# EAGLE schematic Colour Sensor (EAGLE 6.5.0)
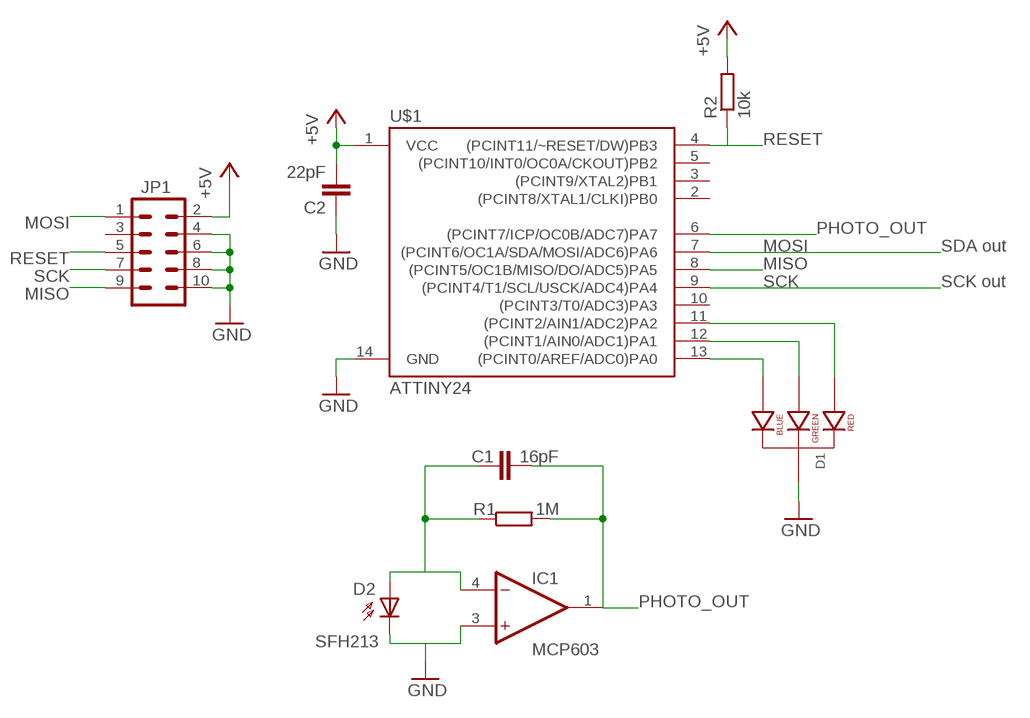
[diagram p0: schematic, sheet 1]

## Parts
C1  16pF  C-EU025-024X044  [C025-024X044]
C2  22pF  C-EU025-024X044  [C025-024X044]
D1  LED-RGB-CC-THRUCLEAR  [LED-RGB-THRU]
D2  SFH213  BPW32  [BPW32]
IC1  MCP603  MAX4105EUK  [SOT23-5L]
JP1  M05X2SHD  [2X5-SHROUDED]
R1  1M  R-EU_0207/7  [0207/7]
R2  10k  R-EU_0207/7  [0207/7]
U$1  ATTINY24  ATTINY84ATTINY84-20PU  [DIL14]

## Nets
+5V: C2.2 JP1.2 R2.2 U$1.1(VCC)
GND: C2.1 D1.2(CATHODE) D2.K(C) IC1.3(+IN) JP1.4 JP1.6 JP1.8 JP1.10 U$1.14(GND)
MISO: JP1.9 U$1.8((PCINT5/OC1B/MISO/DO/ADC5)PA5)
MOSI: JP1.1 U$1.7((PCINT6/OC1A/SDA/MOSI/ADC6)PA6)
N$1: D1.4(BLUE_CATHODE) U$1.13((PCINT0/AREF/ADC0)PA0)
N$2: D1.3(GREEN_CATHODE) U$1.12((PCINT1/AIN0/ADC1)PA1)
N$3: D1.1(RED_CATHODE) U$1.11((PCINT2/AIN1/ADC2)PA2)
N$4: C1.1 D2.A IC1.4(-IN) R1.1
PHOTO_OUT: C1.2 IC1.1(OUT) R1.2 U$1.6((PCINT7/ICP/OC0B/ADC7)PA7)
RESET: JP1.5 R2.1 U$1.4((PCINT11/~RESET/DW)PB3)
SCK: JP1.7 U$1.9((PCINT4/T1/SCL/USCK/ADC4)PA4)
Unconnected: JP1.3 U$1.2((PCINT8/XTAL1/CLKI)PB0) U$1.3((PCINT9/XTAL2)PB1) U$1.5((PCINT10/INT0/OC0A/CKOUT)PB2) U$1.10((PCINT3/T0/ADC3)PA3)

## Notes on the sheet
- SDA out
- SCK out

## Power pins joined to a net without a drawn wire
VCC: IC1.5(VCC)
VEE: IC1.2(VEE)

## Library data of the parts
C1 C2 = resistor:C-EU: CAPACITOR, European symbol
D1 = SparkFun-LED:LED-RGB-CC-THRU: RGB Through-hole common cathode LED SparkFun Storefront: COM-00105 (Clear) COM-09264 (Diffuse); PROD_ID: DIO-08418
D2 = opto-trans-siemens:BPW32: PHOTO DIODE; OC_FARNELL: unknown; OC_NEWARK: unknown
IC1 = maxim:MAX4105EUK: OP AMP; MPN: MAX4105EUK+T; OC_FARNELL: unknown; OC_NEWARK: 67K5152
JP1 = SparkFun-Connectors:M05X2: Header 5x2 Standard 10-pin dual row 0.1" header. Commonly used with AVR-ISP. Use with Spark Fun Electronics SKU: PRT-00778
R1 R2 = resistor:R-EU_: RESISTOR, European symbol
U$1 = SparkFun-DigitalIC:ATTINY84: Atmel 14-pin 2/4/8kB flash uC